# EAGLE design Adafruit MAX4466 Mic Amp (EAGLE 6.2)
AUTHOR: K. Townsend
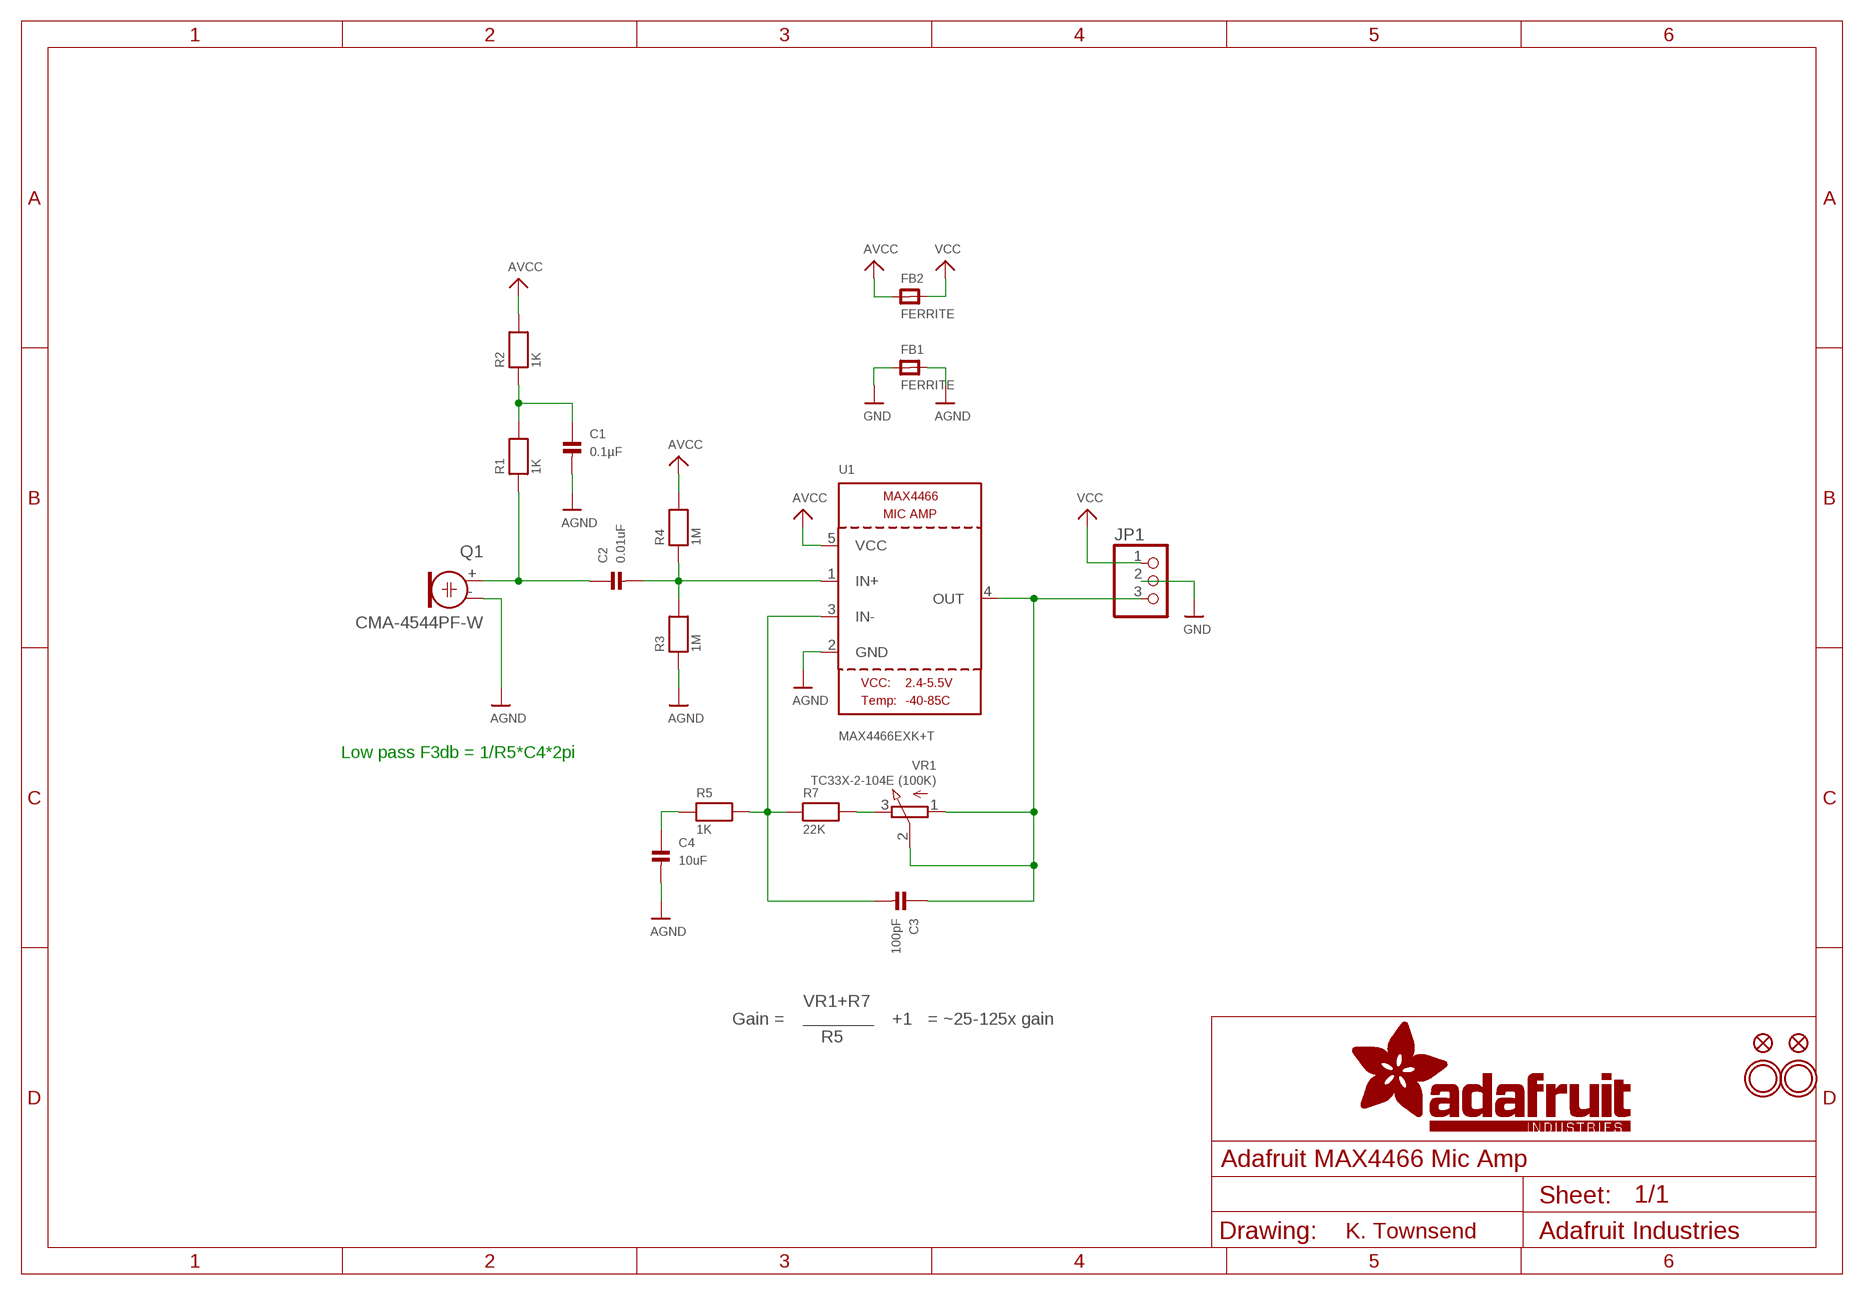
[diagram p0: schematic, sheet 1]

## Parts
C1  0.1µF  CAP_CERAMIC0805  [0805]
C2  0.01uF  CAP_CERAMIC0805  [0805]
C3  100pF  CAP_CERAMIC0805  [0805]
C4  10uF  CAP_CERAMIC0805  [0805]
FB1  FERRITE  FERRITE0805  [0805]
FB2  FERRITE  FERRITE0805  [0805]
FID1  FIDUCIAL""  [FIDUCIAL_1MM]
FID2  FIDUCIAL""  [FIDUCIAL_1MM]
JP1  HEADER-1X376MIL  [1X03_ROUND_76]
Q1  CMA-4544PF-W  ELECTRET  [ELECTRET_9.7]
R1  1K  RESISTOR0805  [0805]
R2  1K  RESISTOR0805  [0805]
R3  1M  RESISTOR0805  [0805]
R4  1M  RESISTOR0805  [0805]
R5  1K  RESISTOR0805  [0805]
R7  22K  RESISTOR0805  [0805]
U1  MAX4466EXK+T  MAX4466""  [SC70-5]
U$11  MOUNTINGHOLE2.5  [MOUNTINGHOLE_2.5_PLATED]
U$14  MOUNTINGHOLE2.5  [MOUNTINGHOLE_2.5_PLATED]
VR1  TC33X-2-104E (100K)  TRIMPOTTC33X-2  [TRIMPOT_BOURNS_TC33X-2]

## Nets
AGND: C1.2 C4.2 FB1.2 Q1.- R3.1 U1.2(GND)
AVCC: FB2.1 R2.2 R4.2 U1.5(VCC)
GND: FB1.1 JP1.2
N$1: C3.2 R5.2 R7.1 U1.3(IN-)
N$2: R7.2 VR1.3(E)
N$3: C2.1 Q1.+ R1.1
N$4: C1.1 R1.2 R2.1
N$5: C2.2 R3.2 R4.1 U1.1(IN+)
N$6: C3.1 JP1.3 U1.4(OUT) VR1.1(A) VR1.2(S)
N$7: C4.1 R5.1
VCC: FB2.2 JP1.1

## Notes on the sheet
- Low pass F3db = 1/R5*C4*2pi
- VR1+R7
- Gain = | +1 | = ~25-125x gain
- R5

## Library data of the parts
C1-C4 = microbuilder:CAP_CERAMIC: Ceramic Capacitors 0402 - 0402 Surface Mount Capacitors 16pF 50V 5% [Digikey: 445-4899-2-ND] 18pF 50V 5% [Digikey: 490-1281-2-ND] 22pF 50V 5% [Digikey: 490-1283-2-ND] 68pF 50V 5% [Digikey: 490-1289-2-ND] 0.1uF 10V 10% [Digikey: 490-1318-2-ND] 1.0uF 6.3V 10% [Digikey: 490-1320-2-ND] 0603 - 0603 Surface Mount Capacitors 16 pF 50V 5% [Digikey: 445-5051-2-ND] 22 pF 50V [Digikey: PCC220ACVTR-ND] 33 pF 50V 5% [Digikey: 490-1415-1-ND] 56pF 50V 5% [Digikey: 490-1421-1-ND] 220pF 50V 5% [Digikey: 445-1285-1-ND] 680 pF 50V 2200 pF 50V 5% C0G [Digikey: 445-1297-1-ND] 5600 pF 100V 5% X7R [Digikey: 478-3711-1-ND] 0.1 µF 25V 10% [Digikey: PCC2277TR-ND] 0.22 µF 16V 10% X7R [Digikey: 445-1318-1-ND] 1.0 µF 25V 10% [Digikey: 445-5146-2-ND] 0603 - RF Specific 3pF 250V +/-0.1pF RF [Digikey: 712-1347-1-ND] 18 pF 250V 5% [Digikey: 478-3505-1-ND or 712-1322-1-ND] 56 pF 250V 5% C0G RF [Digikey: 490-4867-1-ND] 68 pF 250V RF [Digikey: 490-4868-1-ND] 0805 - 0805 Surface Mount Capacitors 220 pF 250V 2% RF Ceramic Capacitor [Digikey: 712-1398-1-ND] 1000 pF 50V 2% NP0 Ceramic Capacitor [Digikey: 478-3760-1-ND] 0.1 µF 25V 10% Ceramic Capacitor [Digikey: PCC1828TR-ND] 1.0 µF 16V 10% Ceramic Capacitor[Digikey: 490-1691-2-ND] 10.0 µF 10V 10% Ceramic Capacitor[Digikey: 709-1228-1-ND] 10.0 uF 16V 10% Ceramic Capacitor [Digikey: 478-5165-2-ND] 47 uF 6.3V 20% Ceramic Capacitor [Digikey: 587-1779-1-ND or 399-5506-1-ND] 1206 - 1206 Surface Mount Capacitors 47uF 10V 20% Ceramic Capacitor [Digikey: 490-5528-1-ND or 399-5508-1-ND or 445-6010-1-ND] 100uF 6.3V -20%, +80% Y5V Ceramic Capacitor (Digikey: 490-4512-1-ND, Mouser: 81-GRM31CF50J107ZE1L)
FB1 FB2 = microbuilder:FERRITE: Ferrite Bead 0603 MMZ1608B121C - 120 Ohm @ 100MHz, 600mA, 0.15 Ohm DC Resistance - Digikey: 445-2164-1-ND BK1608HW121-T - 120 Ohm, 600mA Ferrite Chip - Digikey: 587-1876-2-ND 0805 HZ0805B272R-10 - 2.7K Ohm @ 100MHz, 200mA, 0.8 Ohm DC Resistance - Digikey: 240-2504-1-ND (see also Murata BLM21BD272SN1L) MMZ2012Y152B - 1.5K Ohm @ 100MHz, 500mA, 0.4 Ohm DC Resistance - Digikey: 445-1560-1-ND - Mainly for high frequency (80-400MHz) MMZ2012R102A - 1K Ohm @ 100MHz, 500mA, 0.3 Ohm DC Resistance - Digikey: 445-1555-2-ND - More general purpose (10-200MHz)
FID1 FID2 = microbuilder:FIDUCIAL: Fiducial Alignment Points Various fiducial points for machine vision alignment.
JP1 = microbuilder:HEADER-1X3: PIN HEADER
Q1 = microbuilder:ELECTRET: Electret microphone Thru hole 2.54mm spacing with 9.7mm diameter
R1-R5 R7 = microbuilder:RESISTOR: Resistors 0402 - 0402 Surface Mount Package 22 Ohm 1% 1/16W [Digikey: 311-22.0LRTR-ND] 33 Ohm 5% 1/16W 1.0K 5% 1/16W 1.5K 5% 1/16W 2.0K 1% 1/16W 10.0K 1% 1/16W [Digikey: 311-10.0KLRTR-ND] 10.0K 5% 1/16W [Digikey: RMCF0402JT10K0TR-ND] 12.1K 1% 1/16W [Digikey: 311-22.0LRTR-ND] 100.0K 5% 1/16W 0603 - 0603 Surface Mount Package 0 Ohm 1/10 Watt 1% Resistor 15 Ohm 1/10 Watt 1% Resistor 33 Ohm 1/10 Watt 1% Resistor 49.9 Ohm 1/10 Watt 1% Resistor 100 Ohm 1/10 Watt 1% Resistor 150 Ohm 1/10 Watt 1% Resistor 240 Ohm 1/10 Watt 1% Resistor 390 Ohm 1/10 Watt 1% Resistor 560 Ohm 1/10 Watt 1% Resistor 680 Ohm 1/10 Watt 1% Resistor 750 Ohm 1/10 Watt 1% Resistor 1.0K Ohm 1/10 Watt 1% Resistor 1.5K Ohm 1/10 Watt 1% Resistor 2.0K Ohm 1/10 Watt 1% Resistor 2.2K Ohm 1/10 Watt 1% Resistor 3.3K Ohm 1/10 Watt 1% Resistor 4.7K Ohm 1/10 Watt 1% Resistor 10.0K Ohm 1/10 Watt 1% Resistor 12.0K Ohm 1/10 Watt 1% Resistor 12.1K Ohm 1/10 Watt 1% Resistor 20.0K Ohm 1/10 Watt 1% Resistor 33.0K Ohm 1/10 Watt 1% Resistor 100.0K Ohm 1/10 Watt 1% Resistor 0805 - 0805 Surface Mount Package 0 Ohm 1/8 Watt 1% Resistor 33 Ohm 1/8 Watt 1% Resistor 100 Ohm 1/8 Watt 1% Resistor 150 Ohm 1/8 Watt 1% Resistor 200 Ohm 1/8 Watt 1% Resistor 240 Ohm 1/8 Watt 1% Resistor 330 Ohm 1/8 Watt 1% Resistor 390 Ohm 1/8 Watt 1% Resistor 470 Ohm 1/8 Watt 1% Resistor 1.0K Ohm 1/8 Watt 1% Resistor 1.5K Ohm 1/8 Watt 1% Resistor 2.0K Ohm 1/8 Watt 1% Resistor 4.7K Ohm 1/8 Watt 1% Resistor 5.1K Ohm 1/8 Watt 1% Resistor 5.6K Ohm 1/8 Watt 1% Resistor 10.0K Ohm 1/8 Watt 1% Resistor 22.0K Ohm 1/8 Watt 1% Resistor 33.0K Ohm 1/8 Watt 1% Resistor 100K Ohm 1/8 Watt 1% Resistor 1206 - 1206 Surface Mount Package 2012 - 2010 Surface Mount Package 0.11 Ohm 1/2 Watt 1% Resistor - Digikey: RHM.11UCT-ND
U1 = microbuilder:MAX4466: MAX4466 - Microphone Pre-Amp
U$11 U$14 = microbuilder:MOUNTINGHOLE: Mounting Hole For #2 screws (0.086"/2.18mm width, 0.094"/2.4mm hole) use 2.5mm
VR1 = microbuilder:TRIMPOT: 3-Pin SMT Trimpots Bourns TC33 (X-2) Series 10K - Digikey: TC33X-2-103E 100K - Digikey: TC33X-104ECT-ND Bourns 3303 (W) Series 3mm 10K Single Turn - Digikey: 3303W-103ETR-ND 3mm 100K Single Turn - Digikey: 3303X-104ETR-ND

## Board
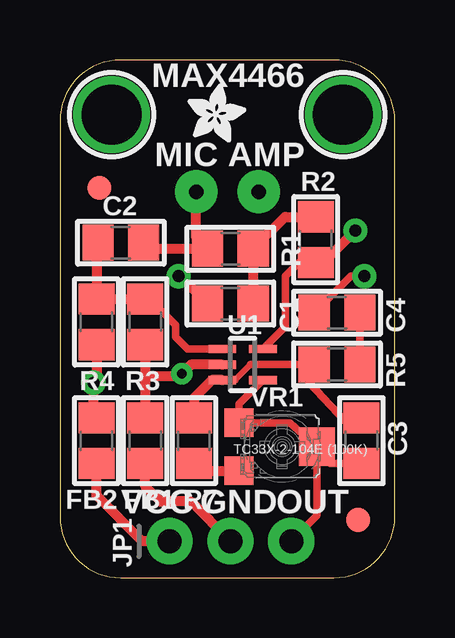
[diagram p1: board, top side]
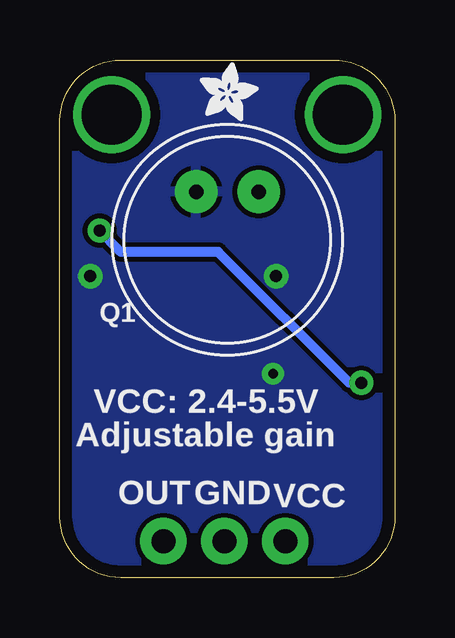
[diagram p2: board, bottom side, seen from below]

Size 13.97 x 21.59 mm. Coordinates in mm from the lower left corner, seen from the top.
Outline: 0,19.05 0,2.54 arc90 2.54,0 11.43,0 arc90 13.97,2.54 13.97,19.05 arc90 11.43,21.59 2.54,21.59 arc90 0,19.05
Copper layers (1*16): Top 0.035mm / dielectric 1.5mm / Bottom 0.035mm
Design rules: minimum track width 8mil, minimum drill 0.4mm, track to track 8mil, track to pad 8mil, pad to pad 8mil, via to via 8mil, smd to smd 8mil, copper to edge 20mil, drill to drill 8mil, minimum pad ring 8mil, minimum via ring 10mil, stop-mask expansion 3mil, vias tented up to drill 20mil, thermal gap 8mil

### Footprints (pad centres in the part's own frame; a part is rotated, then mirrored left to right if it is on the bottom)
0805 = smd 1.3 x 1.5: 1 -0.95,0; 2 0.95,0
FIDUCIAL_1MM = smd 1 x 1: 1 0,0
1X03_ROUND_76 = drill 1 pad 1.93: 1 -2.54,0; 2 0,0; 3 2.54,0
ELECTRET_9.7 = drill 0.6 pad 1.778: + 1.3,2; - -1.3,2
SC70-5 = smd 0.35 x 1.15: 1 -0.65,-0.85; 2 0,-0.85; 3 0.65,-0.85; 4 0.65,0.85; 5 -0.65,0.85
MOUNTINGHOLE_2.5_PLATED = drill 2.5 pad 3.2: P$1 0,0
TRIMPOT_BOURNS_TC33X-2 = smd 1.2 x 1.2: 1 -1,-1.8; 3 1,-1.8 | smd 1.6 x 1.5: 2 0,1.45

### Placement (x,y rotation side)
C1  7.11,11.43 180 top
C2  2.54,13.97 180 top
C3  12.57,5.71 90 top
C4  11.56,11.05 180 top
FB1  3.56,5.71 90 top
FB2  1.52,5.71 270 top
FID1  12.45,2.41 0 top
FID2  1.65,16.26 0 top
JP1  7.11,1.52 0 top
Q1  6.99,14.1 0 bottom
R1  7.11,13.72 0 top
R2  10.67,14.1 270 top
R3  3.56,10.67 90 top
R4  1.52,10.67 270 top
R5  11.56,8.89 180 top
R7  5.59,5.71 270 top
U1  7.62,8.89 270 top
U$11  2.16,19.3 0 top
U$14  11.81,19.3 0 top
U$16  [ADAFRUIT_2.5MM]  5.33,18.16 0 top
U$17  [ADAFRUIT_2.5MM]  8.13,19.05 0 bottom
VR1  9.27,5.46 270 top

### Tracks (layer width: path | path; a pad name or v marks a point on that pad's centre or on a via)
AGND  (via drill 0.4, 0.5)
  Top 0.305: C4.2 12.13,12.57 v12.7,12.57
  Top 0.406: 3.81,6.67 FB1.2 3.56,8.38 | U1.2 5.46,8.89 v5.08,8.51 4.95,8.38 3.56,8.38 | C1.2 5.02,12.57 v4.95,12.57 | R3.1 3.56,8.38
  Bottom 0.305: v12.7,12.57 13.08,12.57
  Bottom 0.406: v4.95,12.57 4.95,12.83
  pour Bottom: 0,21.59 13.97,21.59 13.97,0 0.13,-0.25
AVCC  (via drill 0.5)
  Top 0.305: U1.5 9.4,10.47 9.4,12.57 9.97,13.15 R2.2
  Top 0.406: R4.2 1.52,8.26 v1.4,8.13 1.4,6.41 FB2.1 | v12.32,14.48 10.99,13.15 R2.2
  Bottom 0.406: v1.4,8.13 1.91,8.13 7.37,13.59 11.43,13.59 v12.32,14.48
GND
  Top 0.406: JP1.2 5.46,3.17 4.19,3.17 3.56,3.81 FB1.1
N$1
  Top 0.254: 7.3,8.24 7.95,8.89
  Top 0.305: U1.3 7.3,8.24 | 7.95,8.89 R5.2 | C3.2 11.88,6.54 10.41,8.13 10.41,8.83
  Top 0.406: U1.3 6.33,8.24 5.59,7.49 R7.1 | 10.41,8.83 10.47,8.89 R5.2
N$2
  Top 0.406: R7.2 5.64,4.46 VR1.3
N$3
  Top 0.406: Q1.+ 5.68,14.19 R1.1 3.74,13.72 C2.1
N$4
  Top 0.406: C1.1 R1.2 9.39,15.05 R2.1
N$5
  Top 0.305: 4,11.62 R3.2 3.75,11.62 4.83,10.54 4.83,10.03 5.32,9.54 U1.1
  Top 0.406: R3.2 R4.1 1.52,13.9 C2.2
N$6
  Top 0.305: U1.4 7.47,7.24 VR1.1 9.59,6.46 VR1.2 | VR1.2 11.29,4.76 C3.1 | JP1.3 10.72,2.59 VR1.2
N$7
  Top 0.305: C4.1 R5.1
VCC
  Top 0.406: JP1.1 3.43,1.52 1.52,3.43 FB2.2

### Text on the board
tPlace: MAX4466 | MIC AMP | VCC | GND | OUT
bPlace: VCC: 2.4-5.5V | Adjustable gain | VCC | GND | OUT